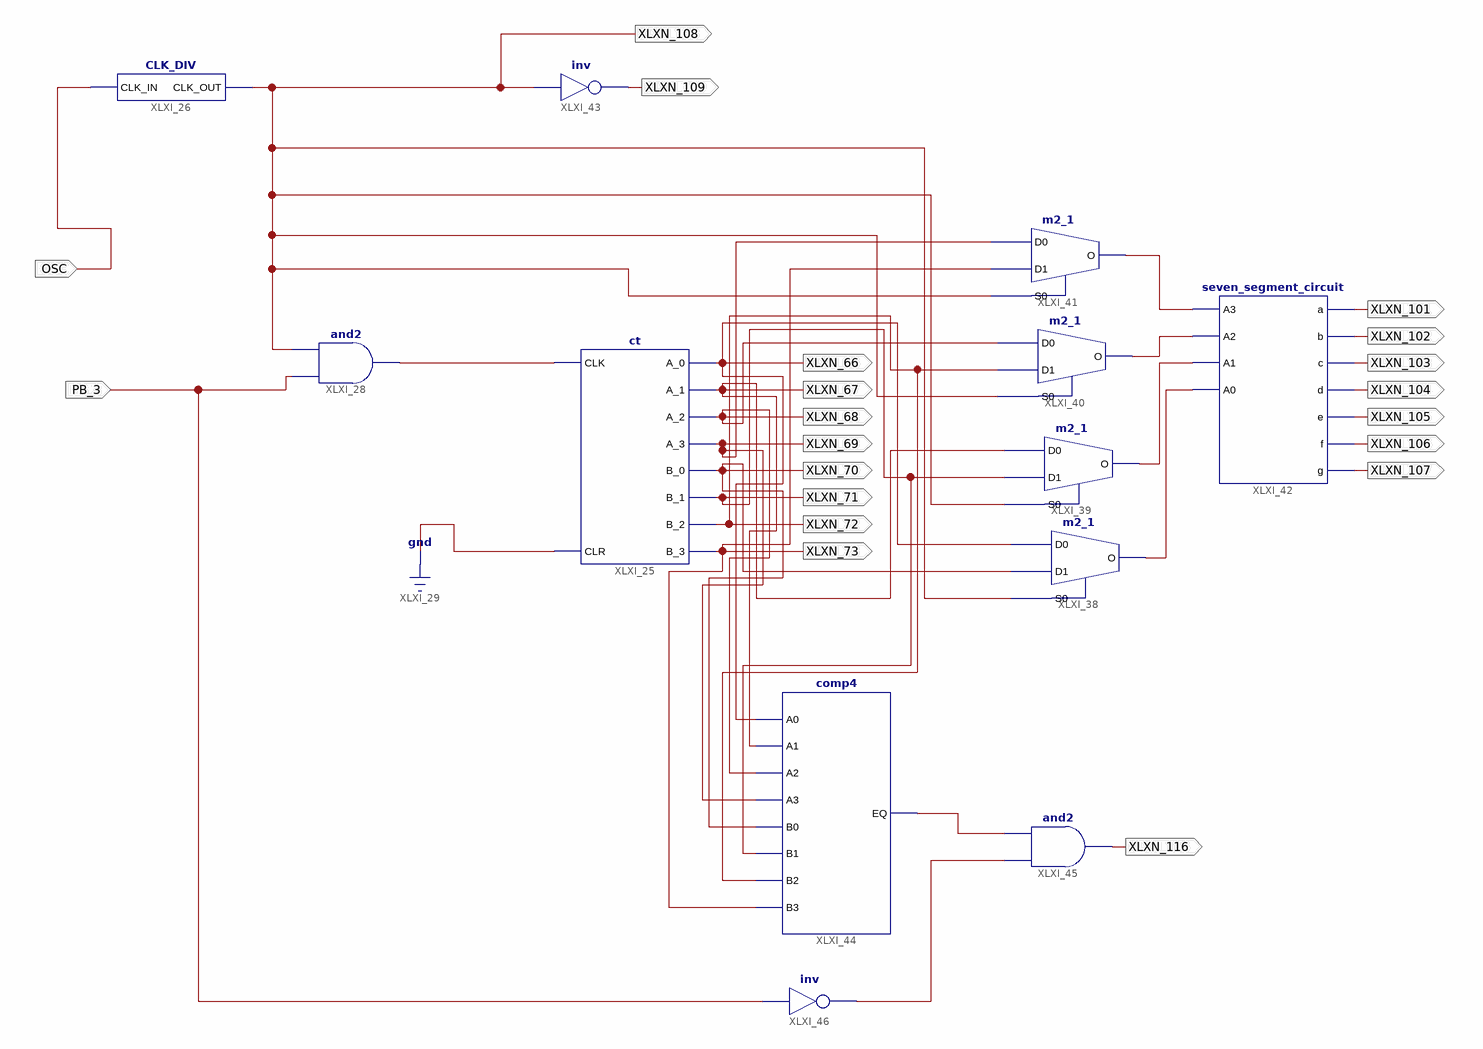
[diagram p0: schematic sheet 1]
// Xilinx ISE schematic main.sch (spartan6) as structural Verilog: 12 symbols, 20 ports
module main (
  input  PB_3,
  input  OSC,
  output XLXN_66,
  output XLXN_67,
  output XLXN_68,
  output XLXN_69,
  output XLXN_70,
  output XLXN_71,
  output XLXN_72,
  output XLXN_73,
  output XLXN_101,
  output XLXN_102,
  output XLXN_103,
  output XLXN_104,
  output XLXN_105,
  output XLXN_106,
  output XLXN_107,
  output XLXN_108,
  output XLXN_109,
  output XLXN_116
);

  wire XLXN_64, XLXN_97, XLXN_98, XLXN_99, XLXN_100, XLXN_112, XLXN_115;

  ct XLXI_25 (
    .CLK(XLXN_64), .CLR(1'b0), .A_0(XLXN_66), .A_1(XLXN_67), .A_2(XLXN_68), .A_3(XLXN_69), .B_0(XLXN_70),
    .B_1(XLXN_71), .B_2(XLXN_72), .B_3(XLXN_73));
  CLK_DIV XLXI_26 (.CLK_IN(OSC), .CLK_OUT(XLXN_108));
  and XLXI_28 (XLXN_64, PB_3, XLXN_108);
  m2_1 XLXI_38 (.D0(XLXN_66), .D1(XLXN_70), .S0(XLXN_108), .O(XLXN_97));
  m2_1 XLXI_39 (.D0(XLXN_67), .D1(XLXN_71), .S0(XLXN_108), .O(XLXN_98));
  m2_1 XLXI_40 (.D0(XLXN_68), .D1(XLXN_72), .S0(XLXN_108), .O(XLXN_99));
  m2_1 XLXI_41 (.D0(XLXN_69), .D1(XLXN_73), .S0(XLXN_108), .O(XLXN_100));
  seven_segment_circuit XLXI_42 (
    .a(XLXN_101), .A0(XLXN_97), .A1(XLXN_98), .A2(XLXN_99), .A3(XLXN_100), .b(XLXN_102), .c(XLXN_103),
    .d(XLXN_104), .e(XLXN_105), .f(XLXN_106), .g(XLXN_107));
  not XLXI_43 (XLXN_109, XLXN_108);
  comp4 XLXI_44 (
    .A0(XLXN_66), .A1(XLXN_67), .A2(XLXN_68), .A3(XLXN_69), .B0(XLXN_70), .B1(XLXN_71), .B2(XLXN_72),
    .B3(XLXN_73), .EQ(XLXN_112));
  and XLXI_45 (XLXN_116, XLXN_115, XLXN_112);
  not XLXI_46 (XLXN_115, PB_3);

  // Notes on the sheet:
  //   LOC on signal XLXN_66 = P82
  //   LOC on signal XLXN_67 = P81
  //   LOC on signal XLXN_68 = P80
  //   LOC on signal XLXN_69 = P79
  //   LOC on signal XLXN_70 = P78
  //   LOC on signal XLXN_71 = P75
  //   LOC on signal XLXN_72 = P74
  //   LOC on signal XLXN_73 = P67
  //   LOC on signal PB_3 = P47
  //   LOC on signal OSC = P123
  //   LOC on signal XLXN_101 = P41
  //   LOC on signal XLXN_102 = P40
  //   LOC on signal XLXN_103 = P35
  //   LOC on signal XLXN_104 = P34
  //   LOC on signal XLXN_105 = P32
  //   LOC on signal XLXN_106 = P29
  //   LOC on signal XLXN_107 = P27
  //   LOC on signal XLXN_108 = P44
  //   LOC on signal XLXN_109 = P43
  //   LOC on signal XLXN_116 = P83
endmodule
